# Altium project NangTVAnhKhoa.PrjPcb
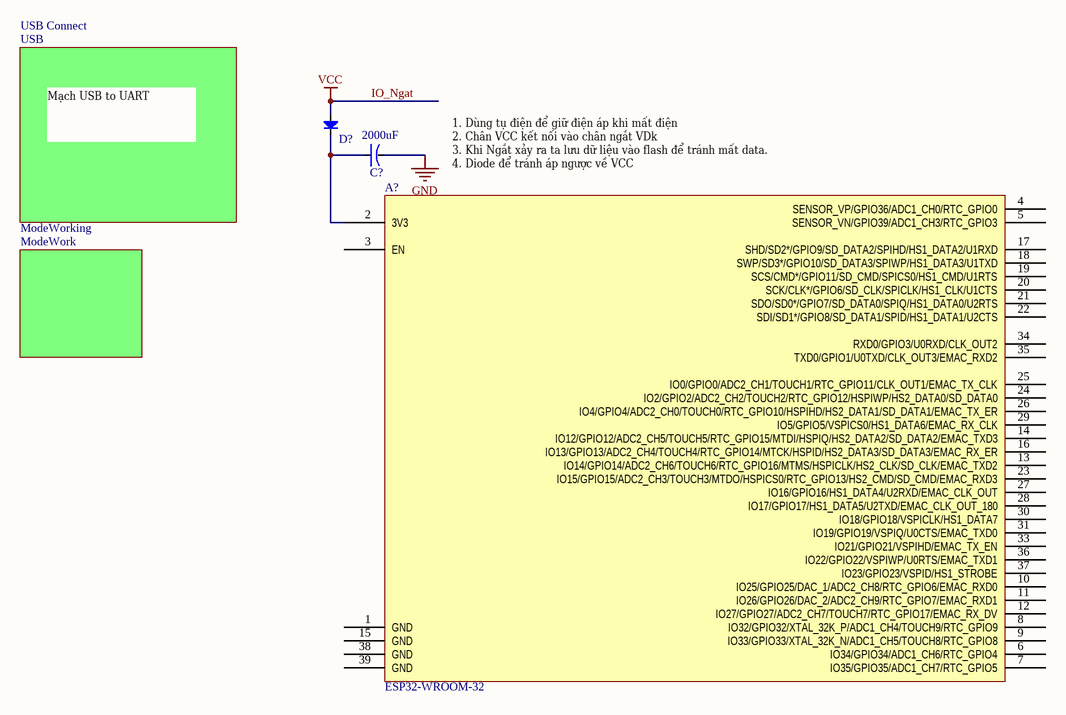
[diagram p0: NangTV.SchDoc]
3 sheets, 20 parts. Net scope: flat (ports and power ports of the same name join across sheets).
Sheets:
  NangTV.SchDoc
    USB Connect = USB.SchDoc
    ModeWorking = ModeWork.SchDoc

## Sheet NangTV.SchDoc
size A

### Parts
(Parts that share a designator on the sheet are numbered #1, #2 ... from top to bottom, then left to right.)
A?  ESP32-WROOM-32  [ESP32-WROOM-32]
C?#1  2000uF  [CAP-ALU-SMD-F]
D?#1  Diode  [DIO-SMD-214AC]  (value not drawn)

### Sub-sheets
ModeWorking = ModeWork: no entries
USB Connect = USB: no entries

### Nets
GND: C?#1.2
IO_Ngat: D?#1.1(A)  [also labelled VCC]
NetA?_2: A?.2(3V3) C?#1.1 D?#1.2(K)

Not connected (* = marked no-connect by the designer): A? 1(GND) 3(EN) 4(SENSOR_VP/GPIO36/ADC1_CH0/RTC_GPIO0) 5(SENSOR_VN/GPIO39/ADC1_CH3/RTC_GPIO3) 6(IO34/GPIO34/ADC1_CH6/RTC_GPIO4) 7(IO35/GPIO35/ADC1_CH7/RTC_GPIO5) 8(IO32/GPIO32/XTAL_32K_P/ADC1_CH4/TOUCH9/RTC_GPIO9) 9(IO33/GPIO33/XTAL_32K_N/ADC1_CH5/TOUCH8/RTC_GPIO8) 10(IO25/GPIO25/DAC_1/ADC2_CH8/RTC_GPIO6/EMAC_RXD0) 11(IO26/GPIO26/DAC_2/ADC2_CH9/RTC_GPIO7/EMAC_RXD1) 12(IO27/GPIO27/ADC2_CH7/TOUCH7/RTC_GPIO17/EMAC_RX_DV) 13(IO14/GPIO14/ADC2_CH6/TOUCH6/RTC_GPIO16/MTMS/HSPICLK/HS2_CLK/SD_CLK/EMAC_TXD2) 14(IO12/GPIO12/ADC2_CH5/TOUCH5/RTC_GPIO15/MTDI/HSPIQ/HS2_DATA2/SD_DATA2/EMAC_TXD3) 15(GND) 16(IO13/GPIO13/ADC2_CH4/TOUCH4/RTC_GPIO14/MTCK/HSPID/HS2_DATA3/SD_DATA3/EMAC_RX_ER) 17(SHD/SD2*/GPIO9/SD_DATA2/SPIHD/HS1_DATA2/U1RXD) 18(SWP/SD3*/GPIO10/SD_DATA3/SPIWP/HS1_DATA3/U1TXD) 19(SCS/CMD*/GPIO11/SD_CMD/SPICS0/HS1_CMD/U1RTS) 20(SCK/CLK*/GPIO6/SD_CLK/SPICLK/HS1_CLK/U1CTS) 21(SDO/SD0*/GPIO7/SD_DATA0/SPIQ/HS1_DATA0/U2RTS) 22(SDI/SD1*/GPIO8/SD_DATA1/SPID/HS1_DATA1/U2CTS) 23(IO15/GPIO15/ADC2_CH3/TOUCH3/MTDO/HSPICS0/RTC_GPIO13/HS2_CMD/SD_CMD/EMAC_RXD3) 24(IO2/GPIO2/ADC2_CH2/TOUCH2/RTC_GPIO12/HSPIWP/HS2_DATA0/SD_DATA0) 25(IO0/GPIO0/ADC2_CH1/TOUCH1/RTC_GPIO11/CLK_OUT1/EMAC_TX_CLK) 26(IO4/GPIO4/ADC2_CH0/TOUCH0/RTC_GPIO10/HSPIHD/HS2_DATA1/SD_DATA1/EMAC_TX_ER) 27(IO16/GPIO16/HS1_DATA4/U2RXD/EMAC_CLK_OUT) 28(IO17/GPIO17/HS1_DATA5/U2TXD/EMAC_CLK_OUT_180) 29(IO5/GPIO5/VSPICS0/HS1_DATA6/EMAC_RX_CLK) 30(IO18/GPIO18/VSPICLK/HS1_DATA7) 31(IO19/GPIO19/VSPIQ/U0CTS/EMAC_TXD0) 33(IO21/GPIO21/VSPIHD/EMAC_TX_EN) 34(RXD0/GPIO3/U0RXD/CLK_OUT2) 35(TXD0/GPIO1/U0TXD/CLK_OUT3/EMAC_RXD2) 36(IO22/GPIO22/VSPIWP/U0RTS/EMAC_TXD1) 37(IO23/GPIO23/VSPID/HS1_STROBE) 38(GND) 39(GND)

### Notes on the sheet
- Mạch USB to UART
- (near A?) 1. Dùng tụ điện để giữ điện áp khi mất điện
  2. Chân VCC kết nối vào chân ngắt VDk
  3. Khi Ngắt xảy ra ta lưu dữ liệu vào flash để tránh mất data.
  4. Diode để tránh áp ngược về VCC

### Library data of the parts
C?#1 = CN-ALU-SMD: Polarized Capacitor (Axial); Published: 8-Jun-2000; LatestRevisionDate: 17-Jul-2002; LatestRevisionNote: Re-released for DXP Platform.; PackageReference: POLAR0.8; Publisher: Altium Limited
D?#1 = Diode: Default Diode; Code - JEDEC: DO-214-AB; Value: 1N5007; Published: 8-Jun-2000; Revision: July-2002: Re-released for DXP Platform.; Publisher: Altium Limited; ComponentLink1Description: ES1J - STMBL; ComponentLink1URL: https://banlinhkien.vn/goods-8089-es1j-do214-diode-1a-600v-sma-es1j-.html

## Sheet USB.SchDoc
size A
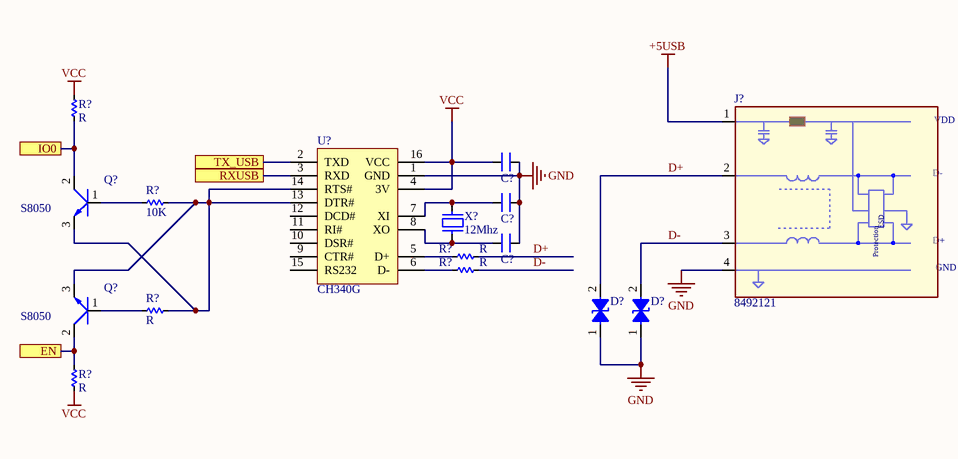
[diagram p1: USB.SchDoc]

### Parts
(Parts that share a designator on the sheet are numbered #1, #2 ... from top to bottom, then left to right.)
C?#2  CN  [CN-SMD-0603_big]  (value not drawn)
C?#3  CN  [CN-SMD-0603_big]  (value not drawn)
C?#4  CN  [CN-SMD-0603_big]  (value not drawn)
D?#2  TVS Diode  [DIO-SMD-214AC]  (value not drawn)
D?#3  TVS Diode  [DIO-SMD-214AC]  (value not drawn)
J?  8492121  [USB-C2]
Q?#1  S8050  [SOT23-123]
Q?#2  S8050  [SOT23-123]
R?#1  R  [RES-SMD-0603_BIG]
R?#2  10K  [RES-SMD-0603_BIG]
R?#3  R  [RES-SMD-0603_BIG]
R?#4  R  [RES-SMD-0603_BIG]
R?#5  R  [RES-SMD-0603_BIG]
R?#6  R  [RES-SMD-0603_BIG]
U?  CH340G  [SO16]
X?  12Mhz  [XT2]

### Ports
EN, IO0, RXUSB, TX_USB

### Nets
+5USB: J?.1(VBUS)
GND: C?#2.1 C?#3.1 C?#4.1 D?#2.1(I/O_1) D?#3.1(I/O_1) J?.4(GND) U?.1(GND)
VCC: C?#2.2 R?#1.1 R?#6.2 U?.4(3V) U?.16(VCC)  [project net IO_Ngat]
D+: D?#2.2(GND) J?.2(D-) R?#3.1
D-: D?#3.2(GND) J?.3(D+) R?#4.1
NetC?#3_2: C?#3.2 U?.7(XI) X?.2
NetC?#4_2: C?#4.2 U?.8(XO) X?.1
NetQ?#1_1: Q?#1.1(B) R?#2.2
NetQ?#1_2: Q?#1.2(C) R?#1.2 ; port IO0
NetQ?#1_3: Q?#1.3(E) Q?#2.3(E) R?#2.1 R?#5.1 U?.13(DTR#) U?.14(RTS#)
NetQ?#2_1: Q?#2.1(B) R?#5.2
NetQ?#2_2: Q?#2.2(C) R?#6.1 ; port EN
NetR?#3_2: R?#3.2 U?.5(D+)
NetR?#4_2: R?#4.2 U?.6(D-)
NetU?_2: U?.2(TXD) ; port TX_USB
NetU?_3: U?.3(RXD) ; port RXUSB

Not connected (* = marked no-connect by the designer): U? 9(CTR#) 10(DSR#) 11(RI#) 12(DCD#) 15(RS232)

### Notes on the sheet
- (in symbol USB-4) VDD; ESD; Protection

### Library data of the parts
C?#2-C?#4 = CN: Value: 33pF
D?#2 D?#3 = TVS Diode: SMAJ5.0A
J? = USB-4: THT USB 2.0 A Connector WE-EPLE; Manufacturer: Würth Elektronik eiSos GmbH; PartNo: 8492121; ComponentLink1Description: Manufacturer; ComponentLink1URL: http://www.we-online.de; Created by: Christin Otto; Created Date: OCT-2014; ComponentLink2Description: Datasheet; ComponentLink2URL: http://www.we-online.de/katalog/media/pdf/8492121.pdf
Q?#1 Q?#2 = S8050: NPN 600mW, ECB; Value: C1815
R?#2 = R
U? = CH340G: High and Low Side Driver; Note: Pins 4, 8 and 14 are not connected; Published: 8-Jun-2000; LatestRevisionDate: 04-Mar-2005; LatestRevisionNote: Stylized 3D Model Added.; DatasheetVersion: PD60147J; PackageReference: PDIP14; Publisher: Altium Limited; PackageDescription: DIP; 14 Leads; Row Spacing 7.62 mm; Pitch 2.54 mm; ComponentLink1Description: Manufacturer Link; ComponentLink1URL: http://www.irf.com/; ComponentLink2Description: Datasheet; ComponentLink2URL: http://www.irf.com/product-info/datasheets/data/ir2110.pdf
X? = XT2: Crystal, 32.768 KHz, -40 to 85 degC, 3.2 x 1.5 x 0.9 mm SMD; Value: 4Mhz

## Sheet ModeWork.SchDoc
size A
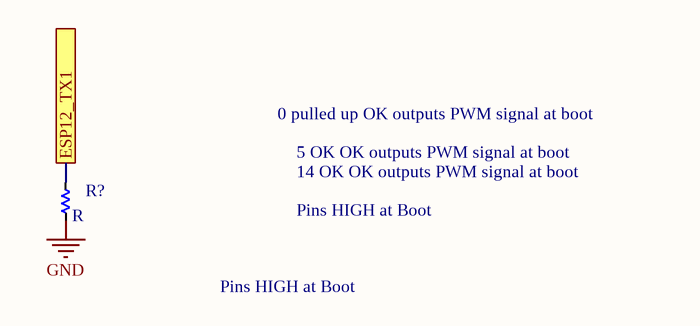
[diagram p2: ModeWork.SchDoc]

### Parts
(Parts that share a designator on the sheet are numbered #1, #2 ... from top to bottom, then left to right.)
R?#7  R  [RES-SMD-0603_BIG]

### Ports
ESP12_TX1

### Nets
GND: R?#7.2
NetR?#7_1: R?#7.1 ; port ESP12_TX1

### Notes on the sheet
- 0 pulled up OK outputs PWM signal at boot
- 5 OK OK outputs PWM signal at boot
- 14 OK OK outputs PWM signal at boot
- Pins HIGH at Boot

## Nets that join several sheets
GND: NangTV (C?#1.2), USB (7 pins), ModeWork (R?#7.2)
IO_Ngat: NangTV (D?#1.1), USB (5 pins)